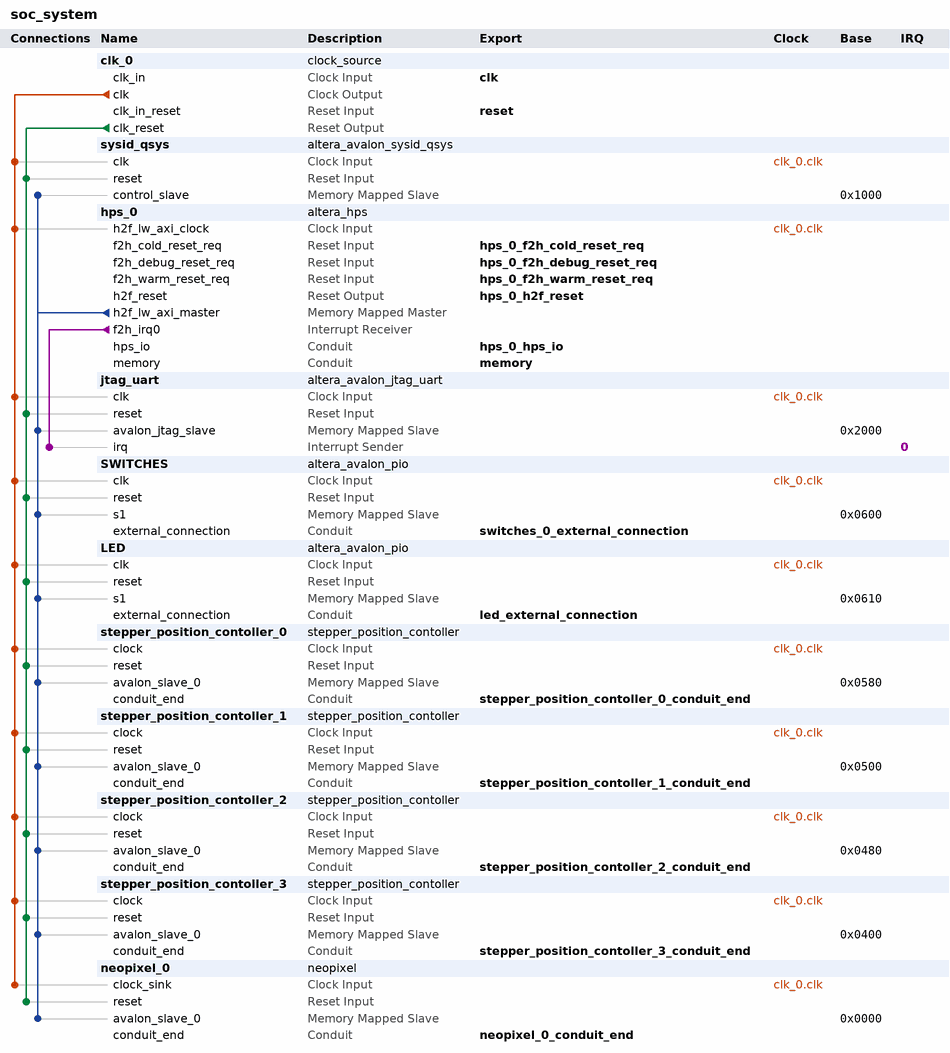
[diagram p0: system contents]
# Platform Designer (Qsys) system soc_system, Cyclone V 5CSEBA6U23I7
# Parameters at their usual value, and those the tool derives, are not listed.
package require -exact qsys 20.1
create_system soc_system
set_project_property DEVICE_FAMILY {Cyclone V}
set_project_property DEVICE 5CSEBA6U23I7

add_instance clk_0 clock_source 20.1
set_instance_parameter_value clk_0 clockFrequency 50000000

add_instance sysid_qsys altera_avalon_sysid_qsys 20.1
set_instance_parameter_value sysid_qsys id -1318387531

add_instance hps_0 altera_hps 20.1
set_instance_parameter_value hps_0 EMAC1_Mode RGMII
set_instance_parameter_value hps_0 EMAC1_PinMuxing {HPS I/O Set 0}
set_instance_parameter_value hps_0 F2SCLK_COLDRST_Enable true
set_instance_parameter_value hps_0 F2SCLK_DBGRST_Enable true
set_instance_parameter_value hps_0 F2SCLK_WARMRST_Enable true
set_instance_parameter_value hps_0 F2SINTERRUPT_Enable true
set_instance_parameter_value hps_0 F2S_Width 0
set_instance_parameter_value hps_0 FPGA_PERIPHERAL_OUTPUT_CLOCK_FREQ_EMAC0_GTX_CLK 100
set_instance_parameter_value hps_0 FPGA_PERIPHERAL_OUTPUT_CLOCK_FREQ_EMAC0_MD_CLK 100.0
set_instance_parameter_value hps_0 FPGA_PERIPHERAL_OUTPUT_CLOCK_FREQ_EMAC1_GTX_CLK 100
set_instance_parameter_value hps_0 FPGA_PERIPHERAL_OUTPUT_CLOCK_FREQ_EMAC1_MD_CLK 100.0
set_instance_parameter_value hps_0 HPS_PROTOCOL DDR3
set_instance_parameter_value hps_0 I2C0_Mode I2C
set_instance_parameter_value hps_0 I2C0_PinMuxing {HPS I/O Set 0}
set_instance_parameter_value hps_0 I2C1_Mode I2C
set_instance_parameter_value hps_0 I2C1_PinMuxing {HPS I/O Set 0}
set_instance_parameter_value hps_0 LWH2F_Enable true
set_instance_parameter_value hps_0 MEM_BANKADDR_WIDTH 3
set_instance_parameter_value hps_0 MEM_CLK_FREQ 400.0
set_instance_parameter_value hps_0 MEM_COL_ADDR_WIDTH 10
set_instance_parameter_value hps_0 MEM_DQ_WIDTH 32
set_instance_parameter_value hps_0 MEM_DRV_STR RZQ/6
set_instance_parameter_value hps_0 MEM_ROW_ADDR_WIDTH 15
set_instance_parameter_value hps_0 MEM_RTT_NOM RZQ/6
set_instance_parameter_value hps_0 MEM_RTT_WR {Dynamic ODT off}
set_instance_parameter_value hps_0 MEM_TCL 7
set_instance_parameter_value hps_0 MEM_TFAW_NS 37.5
set_instance_parameter_value hps_0 MEM_TRAS_NS 35.0
set_instance_parameter_value hps_0 MEM_TRCD_NS 13.75
set_instance_parameter_value hps_0 MEM_TRFC_NS 300.0
set_instance_parameter_value hps_0 MEM_TRP_NS 13.75
set_instance_parameter_value hps_0 MEM_VENDOR Other
set_instance_parameter_value hps_0 MEM_WTCL 7
set_instance_parameter_value hps_0 QSPI_Mode N/A
set_instance_parameter_value hps_0 QSPI_PinMuxing Unused
set_instance_parameter_value hps_0 REF_CLK_FREQ 25.0
set_instance_parameter_value hps_0 S2FCLK_USER2CLK 5
set_instance_parameter_value hps_0 S2F_Width 0
set_instance_parameter_value hps_0 SDIO_Mode {4-bit Data}
set_instance_parameter_value hps_0 SDIO_PinMuxing {HPS I/O Set 0}
set_instance_parameter_value hps_0 SPIM1_Mode {Single Slave Select}
set_instance_parameter_value hps_0 SPIM1_PinMuxing {HPS I/O Set 0}
set_instance_parameter_value hps_0 STM_Enable false
set_instance_parameter_value hps_0 TIMING_BOARD_AC_SKEW 0.02
set_instance_parameter_value hps_0 TIMING_BOARD_AC_TO_CK_SKEW 0.0
set_instance_parameter_value hps_0 TIMING_BOARD_DQ_TO_DQS_SKEW 0.0
set_instance_parameter_value hps_0 TIMING_BOARD_MAX_CK_DELAY 0.6
set_instance_parameter_value hps_0 TIMING_BOARD_MAX_DQS_DELAY 0.6
set_instance_parameter_value hps_0 TIMING_BOARD_SKEW_BETWEEN_DQS 0.02
set_instance_parameter_value hps_0 TIMING_BOARD_SKEW_CKDQS_DIMM_MAX 0.01
set_instance_parameter_value hps_0 TIMING_BOARD_SKEW_CKDQS_DIMM_MIN -0.01
set_instance_parameter_value hps_0 TIMING_BOARD_SKEW_WITHIN_DQS 0.02
set_instance_parameter_value hps_0 TIMING_TDH 125
set_instance_parameter_value hps_0 TIMING_TDQSCK 400
set_instance_parameter_value hps_0 TIMING_TDQSQ 120
set_instance_parameter_value hps_0 TIMING_TDS 50
set_instance_parameter_value hps_0 TIMING_TIH 250
set_instance_parameter_value hps_0 TIMING_TIS 175
set_instance_parameter_value hps_0 TIMING_TQSH 0.38
set_instance_parameter_value hps_0 UART0_Mode {No Flow Control}
set_instance_parameter_value hps_0 UART0_PinMuxing {HPS I/O Set 0}
set_instance_parameter_value hps_0 USB1_Mode SDR
set_instance_parameter_value hps_0 USB1_PinMuxing {HPS I/O Set 0}
set_instance_parameter_value hps_0 desired_cfg_clk_mhz 100.0
set_instance_parameter_value hps_0 desired_qspi_clk_mhz 370.0

add_instance jtag_uart altera_avalon_jtag_uart 20.1
set_instance_parameter_value jtag_uart allowMultipleConnections true
set_instance_parameter_value jtag_uart simInteractiveOptions INTERACTIVE_ASCII_OUTPUT

add_instance SWITCHES altera_avalon_pio 20.1
set_instance_parameter_value SWITCHES direction Input
set_instance_parameter_value SWITCHES width 4

add_instance LED altera_avalon_pio 20.1
set_instance_parameter_value LED direction Output
set_instance_parameter_value LED width 8

add_instance stepper_position_contoller_0 stepper_position_contoller 1.0
set_instance_parameter_value stepper_position_contoller_0 CLOCK_FREQ_HZ 50000000

add_instance stepper_position_contoller_1 stepper_position_contoller 1.0
set_instance_parameter_value stepper_position_contoller_1 CLOCK_FREQ_HZ 50000000

add_instance stepper_position_contoller_2 stepper_position_contoller 1.0
set_instance_parameter_value stepper_position_contoller_2 CLOCK_FREQ_HZ 50000000

add_instance stepper_position_contoller_3 stepper_position_contoller 1.0
set_instance_parameter_value stepper_position_contoller_3 CLOCK_FREQ_HZ 50000000

add_instance neopixel_0 neopixel 1.0
set_instance_parameter_value neopixel_0 CLOCK_SPEED_HZ 50000000
set_instance_parameter_value neopixel_0 NUMBER_OF_NEOPIXEL 12

# connections
add_connection clk_0.clk hps_0.h2f_lw_axi_clock clock
add_connection clk_0.clk jtag_uart.clk clock
add_connection clk_0.clk LED.clk clock
add_connection clk_0.clk neopixel_0.clock_sink clock
add_connection clk_0.clk stepper_position_contoller_0.clock clock
add_connection clk_0.clk stepper_position_contoller_1.clock clock
add_connection clk_0.clk stepper_position_contoller_2.clock clock
add_connection clk_0.clk stepper_position_contoller_3.clock clock
add_connection clk_0.clk SWITCHES.clk clock
add_connection clk_0.clk sysid_qsys.clk clock
add_connection clk_0.clk_reset jtag_uart.reset reset
add_connection clk_0.clk_reset LED.reset reset
add_connection clk_0.clk_reset neopixel_0.reset reset
add_connection clk_0.clk_reset stepper_position_contoller_0.reset reset
add_connection clk_0.clk_reset stepper_position_contoller_1.reset reset
add_connection clk_0.clk_reset stepper_position_contoller_2.reset reset
add_connection clk_0.clk_reset stepper_position_contoller_3.reset reset
add_connection clk_0.clk_reset SWITCHES.reset reset
add_connection clk_0.clk_reset sysid_qsys.reset reset
add_connection hps_0.h2f_lw_axi_master jtag_uart.avalon_jtag_slave avalon
set_connection_parameter_value hps_0.h2f_lw_axi_master/jtag_uart.avalon_jtag_slave baseAddress 0x2000
add_connection hps_0.h2f_lw_axi_master LED.s1 avalon
set_connection_parameter_value hps_0.h2f_lw_axi_master/LED.s1 baseAddress 0x0610
add_connection hps_0.h2f_lw_axi_master neopixel_0.avalon_slave_0 avalon
set_connection_parameter_value hps_0.h2f_lw_axi_master/neopixel_0.avalon_slave_0 baseAddress 0x0000
add_connection hps_0.h2f_lw_axi_master stepper_position_contoller_0.avalon_slave_0 avalon
set_connection_parameter_value hps_0.h2f_lw_axi_master/stepper_position_contoller_0.avalon_slave_0 baseAddress 0x0580
add_connection hps_0.h2f_lw_axi_master stepper_position_contoller_1.avalon_slave_0 avalon
set_connection_parameter_value hps_0.h2f_lw_axi_master/stepper_position_contoller_1.avalon_slave_0 baseAddress 0x0500
add_connection hps_0.h2f_lw_axi_master stepper_position_contoller_2.avalon_slave_0 avalon
set_connection_parameter_value hps_0.h2f_lw_axi_master/stepper_position_contoller_2.avalon_slave_0 baseAddress 0x0480
add_connection hps_0.h2f_lw_axi_master stepper_position_contoller_3.avalon_slave_0 avalon
set_connection_parameter_value hps_0.h2f_lw_axi_master/stepper_position_contoller_3.avalon_slave_0 baseAddress 0x0400
add_connection hps_0.h2f_lw_axi_master SWITCHES.s1 avalon
set_connection_parameter_value hps_0.h2f_lw_axi_master/SWITCHES.s1 baseAddress 0x0600
add_connection hps_0.h2f_lw_axi_master sysid_qsys.control_slave avalon
set_connection_parameter_value hps_0.h2f_lw_axi_master/sysid_qsys.control_slave baseAddress 0x1000
add_connection hps_0.f2h_irq0 jtag_uart.irq interrupt
set_connection_parameter_value hps_0.f2h_irq0/jtag_uart.irq irqNumber 0

# exported interfaces
add_interface clk clock sink
set_interface_property clk EXPORT_OF clk_0.clk_in
add_interface hps_0_f2h_cold_reset_req reset sink
set_interface_property hps_0_f2h_cold_reset_req EXPORT_OF hps_0.f2h_cold_reset_req
add_interface hps_0_f2h_debug_reset_req reset sink
set_interface_property hps_0_f2h_debug_reset_req EXPORT_OF hps_0.f2h_debug_reset_req
add_interface hps_0_f2h_warm_reset_req reset sink
set_interface_property hps_0_f2h_warm_reset_req EXPORT_OF hps_0.f2h_warm_reset_req
add_interface hps_0_h2f_reset reset source
set_interface_property hps_0_h2f_reset EXPORT_OF hps_0.h2f_reset
add_interface hps_0_hps_io conduit end
set_interface_property hps_0_hps_io EXPORT_OF hps_0.hps_io
add_interface led_external_connection conduit end
set_interface_property led_external_connection EXPORT_OF LED.external_connection
add_interface memory conduit end
set_interface_property memory EXPORT_OF hps_0.memory
add_interface neopixel_0_conduit_end conduit end
set_interface_property neopixel_0_conduit_end EXPORT_OF neopixel_0.conduit_end
add_interface reset reset sink
set_interface_property reset EXPORT_OF clk_0.clk_in_reset
add_interface stepper_position_contoller_0_conduit_end conduit end
set_interface_property stepper_position_contoller_0_conduit_end EXPORT_OF stepper_position_contoller_0.conduit_end
add_interface stepper_position_contoller_1_conduit_end conduit end
set_interface_property stepper_position_contoller_1_conduit_end EXPORT_OF stepper_position_contoller_1.conduit_end
add_interface stepper_position_contoller_2_conduit_end conduit end
set_interface_property stepper_position_contoller_2_conduit_end EXPORT_OF stepper_position_contoller_2.conduit_end
add_interface stepper_position_contoller_3_conduit_end conduit end
set_interface_property stepper_position_contoller_3_conduit_end EXPORT_OF stepper_position_contoller_3.conduit_end
add_interface switches_0_external_connection conduit end
set_interface_property switches_0_external_connection EXPORT_OF SWITCHES.external_connection

set_interconnect_requirement {$system} qsys_mm.clockCrossingAdapter HANDSHAKE
set_interconnect_requirement {$system} qsys_mm.maxAdditionalLatency 1

save_system soc_system.qsys
